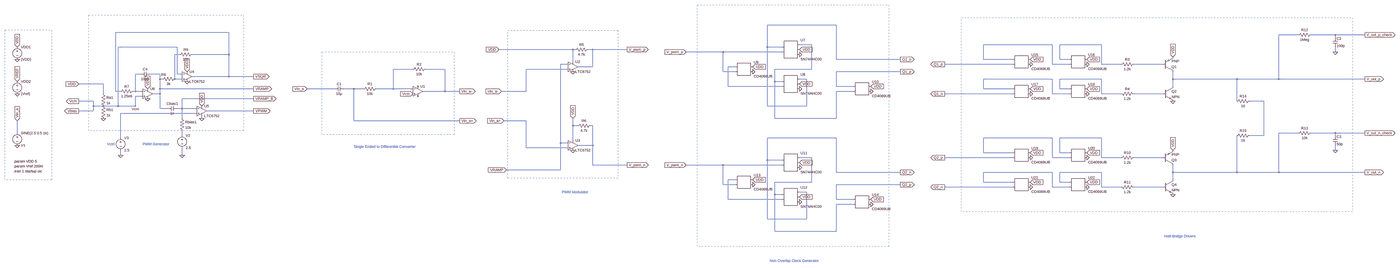
[diagram p0: schematic Ex 5.asc, whole sheet]
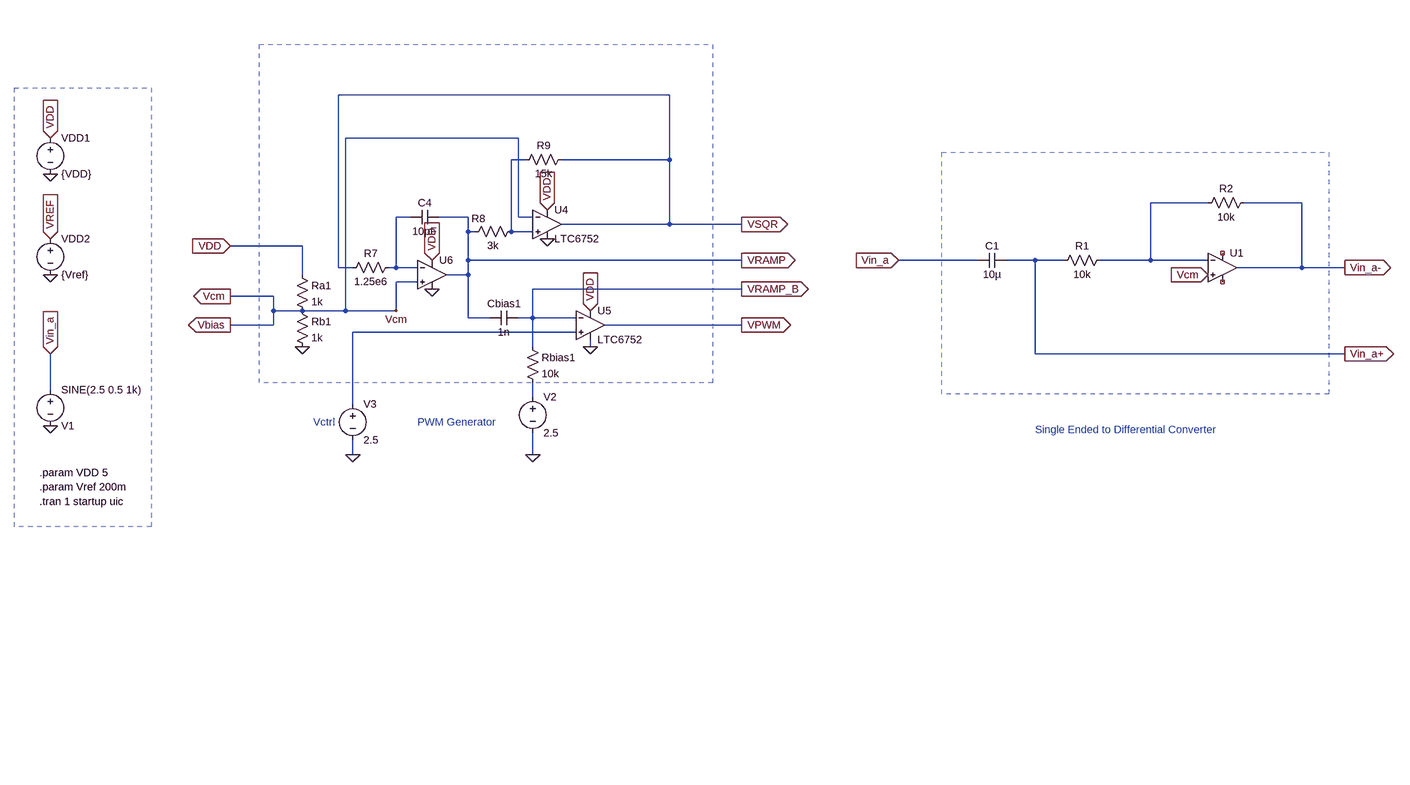
[diagram p1: schematic Ex 5.asc, part, row 1 of 1, column 1 of 3]
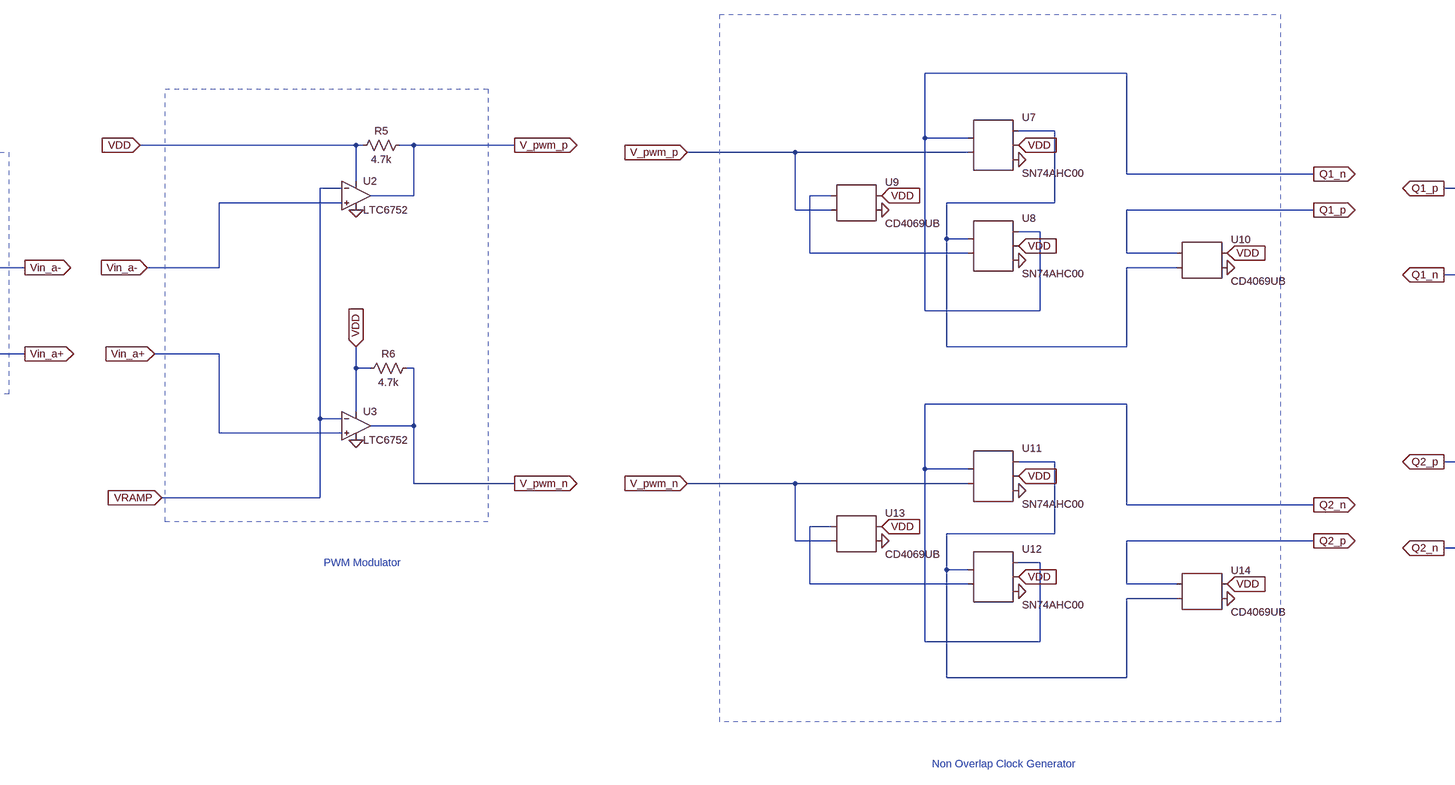
[diagram p2: schematic Ex 5.asc, part, row 1 of 1, column 2 of 3]
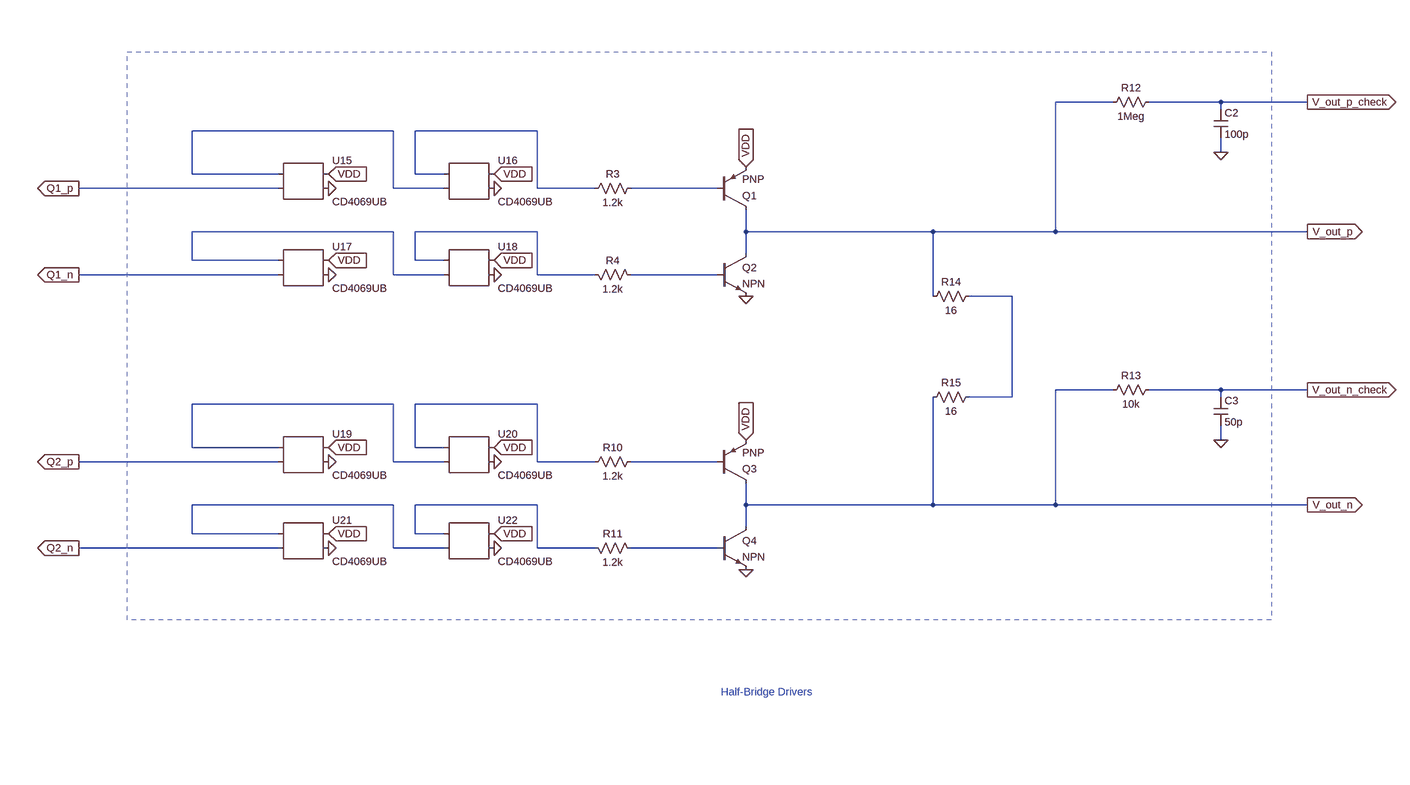
[diagram p3: schematic Ex 5.asc, part, row 1 of 1, column 3 of 3]
Ex 5.asc, the LTspice schematic file:
Version 4
SHEET 1 6252 1008
WIRE 2416 -544 1968 -544
WIRE -1536 -496 -2272 -496
WIRE 5584 -480 5456 -480
WIRE 5824 -480 5664 -480
WIRE 6016 -480 5824 -480
WIRE 5824 -464 5824 -480
WIRE 2256 -416 2176 -416
WIRE 3984 -416 3536 -416
WIRE 4304 -416 4032 -416
WIRE -1872 -400 -2256 -400
WIRE 1968 -400 1968 -544
WIRE 2064 -400 1968 -400
WIRE 704 -384 224 -384
WIRE 720 -384 704 -384
WIRE 832 -384 800 -384
WIRE 1056 -384 832 -384
WIRE 1680 -368 1440 -368
WIRE 2064 -368 1680 -368
WIRE 5824 -368 5824 -400
WIRE -1856 -352 -1888 -352
WIRE -1536 -352 -1536 -496
WIRE -1536 -352 -1776 -352
WIRE 2416 -320 2416 -544
WIRE 2832 -320 2416 -320
WIRE 3536 -320 3536 -416
WIRE 3728 -320 3536 -320
WIRE 4032 -320 4032 -416
WIRE 4096 -320 4032 -320
WIRE 704 -304 704 -384
WIRE 672 -288 624 -288
WIRE 3728 -288 3280 -288
WIRE 3984 -288 3984 -416
WIRE 4096 -288 3984 -288
WIRE 4304 -288 4304 -416
WIRE 4432 -288 4304 -288
WIRE 4704 -288 4512 -288
WIRE 832 -272 832 -384
WIRE 832 -272 736 -272
WIRE 1760 -272 1712 -272
WIRE -336 -256 -464 -256
WIRE -128 -256 -256 -256
WIRE 672 -256 400 -256
WIRE 2256 -256 2256 -416
WIRE 2256 -256 2016 -256
WIRE 1680 -240 1680 -368
WIRE 1760 -240 1680 -240
WIRE 2832 -240 2416 -240
WIRE -2112 -224 -2144 -224
WIRE -1984 -224 -2048 -224
WIRE -1872 -224 -1872 -400
WIRE -1840 -224 -1872 -224
WIRE -1536 -208 -1536 -352
WIRE -1536 -208 -1776 -208
WIRE -1376 -208 -1536 -208
WIRE -1984 -192 -1984 -224
WIRE -1968 -192 -1984 -192
WIRE -1888 -192 -1888 -352
WIRE -1840 -192 -1888 -192
WIRE 2224 -192 2176 -192
WIRE 3984 -192 3536 -192
WIRE 4304 -192 4032 -192
WIRE 4768 -192 4768 -240
WIRE 5184 -192 4768 -192
WIRE 5456 -192 5456 -480
WIRE 5456 -192 5184 -192
WIRE 6016 -192 5456 -192
WIRE 2016 -176 2016 -256
WIRE 2064 -176 2016 -176
WIRE -2352 -160 -2512 -160
WIRE 1712 -144 1712 -272
WIRE 2064 -144 1712 -144
WIRE 2416 -144 2416 -240
WIRE 2528 -144 2416 -144
WIRE 4768 -144 4768 -192
WIRE -1984 -128 -1984 -192
WIRE -1376 -128 -1984 -128
WIRE -848 -128 -1024 -128
WIRE -720 -128 -784 -128
WIRE -656 -128 -720 -128
WIRE -464 -128 -464 -256
WIRE -464 -128 -576 -128
WIRE -336 -128 -464 -128
WIRE 3536 -128 3536 -192
WIRE 3728 -128 3536 -128
WIRE 4032 -128 4032 -192
WIRE 4096 -128 4032 -128
WIRE -2272 -112 -2272 -496
WIRE -2240 -112 -2272 -112
WIRE -2144 -112 -2144 -224
WIRE -2144 -112 -2160 -112
WIRE -2096 -112 -2144 -112
WIRE -128 -112 -128 -256
WIRE -128 -112 -272 -112
WIRE -32 -112 -128 -112
WIRE 400 -112 400 -256
WIRE 400 -112 240 -112
WIRE 2528 -112 2416 -112
WIRE -2352 -96 -2352 -160
WIRE -1984 -96 -1984 -128
WIRE -1984 -96 -2032 -96
WIRE 3728 -96 3280 -96
WIRE 3984 -96 3984 -192
WIRE 4096 -96 3984 -96
WIRE 4304 -96 4304 -192
WIRE 4432 -96 4304 -96
WIRE 4704 -96 4512 -96
WIRE -2096 -80 -2144 -80
WIRE -1376 -64 -1840 -64
WIRE -2416 -48 -2512 -48
WIRE 5184 -48 5184 -192
WIRE 5360 -48 5264 -48
WIRE -2416 -16 -2416 -48
WIRE -2352 -16 -2416 -16
WIRE -2256 -16 -2256 -400
WIRE -2256 -16 -2352 -16
WIRE -2144 -16 -2144 -80
WIRE -2144 -16 -2256 -16
WIRE 1968 -16 1968 -400
WIRE 2224 -16 2224 -192
WIRE 2224 -16 1968 -16
WIRE -1984 0 -1984 -96
WIRE -1936 0 -1984 0
WIRE -1840 0 -1840 -64
WIRE -1840 0 -1872 0
WIRE -1744 0 -1840 0
WIRE -2416 16 -2416 -16
WIRE -2416 16 -2512 16
WIRE -1376 16 -1680 16
WIRE -1744 32 -2240 32
WIRE -1840 64 -1840 0
WIRE -1712 64 -1712 48
WIRE 2016 64 2016 -176
WIRE 2416 64 2416 -112
WIRE 2416 64 2016 64
WIRE -720 80 -720 -128
WIRE -32 80 -720 80
WIRE 400 80 256 80
WIRE 704 112 704 64
WIRE 736 112 704 112
WIRE 832 112 816 112
WIRE -2912 160 -2912 80
WIRE 5584 160 5456 160
WIRE 5824 160 5664 160
WIRE 6016 160 5824 160
WIRE -1840 176 -1840 144
WIRE 5360 176 5360 -48
WIRE 5360 176 5264 176
WIRE 5824 176 5824 160
WIRE -2240 192 -2240 32
WIRE 2416 192 1968 192
WIRE 3984 192 3536 192
WIRE 4304 192 4032 192
WIRE 704 208 704 112
WIRE 624 224 624 -288
WIRE 672 224 624 224
WIRE 832 240 832 112
WIRE 832 240 736 240
WIRE 400 256 400 80
WIRE 672 256 400 256
WIRE 5824 272 5824 240
WIRE 3536 288 3536 192
WIRE 3728 288 3536 288
WIRE 4032 288 4032 192
WIRE 4096 288 4032 288
WIRE -2240 304 -2240 272
WIRE -1840 304 -1840 256
WIRE 2256 320 2176 320
WIRE 3728 320 3280 320
WIRE 3984 320 3984 192
WIRE 4096 320 3984 320
WIRE 4304 320 4304 192
WIRE 4432 320 4304 320
WIRE 4704 320 4512 320
WIRE 1968 336 1968 192
WIRE 2064 336 1968 336
WIRE 832 368 832 240
WIRE 1056 368 832 368
WIRE 1680 368 1440 368
WIRE 2064 368 1680 368
WIRE 624 400 624 224
WIRE 624 400 272 400
WIRE 2416 416 2416 192
WIRE 2832 416 2416 416
WIRE 3984 416 3536 416
WIRE 4304 416 4032 416
WIRE 4768 416 4768 368
WIRE 5184 416 5184 176
WIRE 5184 416 4768 416
WIRE 5456 416 5456 160
WIRE 5456 416 5184 416
WIRE 6016 416 5456 416
WIRE 1760 464 1712 464
WIRE 4768 464 4768 416
WIRE 2256 480 2256 320
WIRE 2256 480 2016 480
WIRE 3536 480 3536 416
WIRE 3728 480 3536 480
WIRE 4032 480 4032 416
WIRE 4096 480 4032 480
WIRE 1680 496 1680 368
WIRE 1760 496 1680 496
WIRE 2832 496 2416 496
WIRE 3728 512 3280 512
WIRE 3984 512 3984 416
WIRE 4096 512 3984 512
WIRE 4304 512 4304 416
WIRE 4432 512 4304 512
WIRE 4704 512 4512 512
WIRE 2224 544 2176 544
WIRE 2016 560 2016 480
WIRE 2064 560 2016 560
WIRE 1712 592 1712 464
WIRE 2064 592 1712 592
WIRE 2416 592 2416 496
WIRE 2528 592 2416 592
WIRE 2528 624 2416 624
WIRE 1968 720 1968 336
WIRE 2224 720 2224 544
WIRE 2224 720 1968 720
WIRE 2016 800 2016 560
WIRE 2416 800 2416 624
WIRE 2416 800 2016 800
FLAG -1024 -128 Vin_a
IOPIN -1024 -128 In
FLAG -32 -112 Vin_a-
IOPIN -32 -112 Out
FLAG -32 80 Vin_a+
IOPIN -32 80 Out
FLAG 272 400 VRAMP
IOPIN 272 400 In
FLAG 240 -112 Vin_a-
IOPIN 240 -112 In
FLAG 256 80 Vin_a+
IOPIN 256 80 In
FLAG 1056 -384 V_pwm_p
IOPIN 1056 -384 Out
FLAG 1056 368 V_pwm_n
IOPIN 1056 368 Out
FLAG 224 -384 VDD
IOPIN 224 -384 In
FLAG 704 64 VDD
IOPIN 704 64 In
FLAG 704 -240 0
FLAG 704 272 0
FLAG -2912 240 0
FLAG -2912 80 Vin_a
IOPIN -2912 80 In
FLAG -336 -96 Vcm
IOPIN -336 -96 In
FLAG -2352 64 0
FLAG -1808 -176 0
FLAG -2064 -64 0
FLAG -1712 64 0
FLAG -2144 -16 Vcm
FLAG -1376 -208 VSQR
IOPIN -1376 -208 Out
FLAG -1376 -128 VRAMP
IOPIN -1376 -128 Out
FLAG -2064 -128 VDD
IOPIN -2064 -128 In
FLAG -1808 -240 VDD
IOPIN -1808 -240 In
FLAG -1712 -16 VDD
IOPIN -1712 -16 In
FLAG -1376 16 VPWM
IOPIN -1376 16 Out
FLAG -1376 -64 VRAMP_B
IOPIN -1376 -64 Out
FLAG -2512 -160 VDD
IOPIN -2512 -160 In
FLAG -2912 -320 0
FLAG -2912 -400 VDD
IOPIN -2912 -400 In
FLAG -2912 -96 0
FLAG -2912 -176 VREF
IOPIN -2912 -176 In
FLAG -1840 304 0
FLAG -2240 304 0
FLAG -2512 -48 Vcm
IOPIN -2512 -48 Out
FLAG -2512 16 Vbias
IOPIN -2512 16 Out
FLAG 2176 -384 VDD
IOPIN 2176 -384 In
FLAG 2176 -160 VDD
IOPIN 2176 -160 In
FLAG 2176 -352 0
FLAG 2176 -128 0
FLAG 1440 -368 V_pwm_p
IOPIN 1440 -368 In
FLAG 2832 -320 Q1_n
IOPIN 2832 -320 Out
FLAG 2832 -240 Q1_p
IOPIN 2832 -240 Out
FLAG 2640 -144 VDD
IOPIN 2640 -144 In
FLAG 2640 -112 0
FLAG 2176 352 VDD
IOPIN 2176 352 In
FLAG 2176 576 VDD
IOPIN 2176 576 In
FLAG 2176 384 0
FLAG 2176 608 0
FLAG 1440 368 V_pwm_n
IOPIN 1440 368 In
FLAG 2832 416 Q2_n
IOPIN 2832 416 Out
FLAG 2832 496 Q2_p
IOPIN 2832 496 Out
FLAG 2640 592 VDD
IOPIN 2640 592 In
FLAG 2640 624 0
FLAG 1872 -272 VDD
IOPIN 1872 -272 In
FLAG 1872 464 VDD
IOPIN 1872 464 In
FLAG 1872 -240 0
FLAG 1872 496 0
FLAG 3840 -320 VDD
IOPIN 3840 -320 In
FLAG 3840 -128 VDD
IOPIN 3840 -128 In
FLAG 4208 -320 VDD
IOPIN 4208 -320 In
FLAG 4208 -128 VDD
IOPIN 4208 -128 In
FLAG 3840 -288 0
FLAG 3840 -96 0
FLAG 4208 -288 0
FLAG 4208 -96 0
FLAG 4768 -336 VDD
IOPIN 4768 -336 In
FLAG 4768 -48 0
FLAG 3280 -288 Q1_p
IOPIN 3280 -288 Out
FLAG 3280 -96 Q1_n
IOPIN 3280 -96 Out
FLAG 6016 -192 V_out_p
IOPIN 6016 -192 Out
FLAG 3840 288 VDD
IOPIN 3840 288 In
FLAG 3840 480 VDD
IOPIN 3840 480 In
FLAG 4208 288 VDD
IOPIN 4208 288 In
FLAG 4208 480 VDD
IOPIN 4208 480 In
FLAG 3840 320 0
FLAG 3840 512 0
FLAG 4208 320 0
FLAG 4208 512 0
FLAG 4768 272 VDD
IOPIN 4768 272 In
FLAG 4768 560 0
FLAG 3280 320 Q2_p
IOPIN 3280 320 Out
FLAG 3280 512 Q2_n
IOPIN 3280 512 Out
FLAG 6016 416 V_out_n
IOPIN 6016 416 Out
FLAG 5824 -368 0
FLAG 6016 -480 V_out_p_check
IOPIN 6016 -480 Out
FLAG 5824 272 0
FLAG 6016 160 V_out_n_check
IOPIN 6016 160 Out
SYMBOL cap -784 -144 R90
WINDOW 0 0 32 VBottom 2
WINDOW 3 32 32 VTop 2
SYMATTR InstName C1
SYMATTR Value 10µ
SYMBOL res -560 -144 R90
WINDOW 0 0 56 VBottom 2
WINDOW 3 32 56 VTop 2
SYMATTR InstName R1
SYMATTR Value 10k
SYMBOL res -240 -272 R90
WINDOW 0 0 56 VBottom 2
WINDOW 3 32 56 VTop 2
SYMATTR InstName R2
SYMATTR Value 10k
SYMBOL OpAmps\\UniversalOpAmp -304 -112 R0
SYMATTR InstName U1
SYMBOL Comparators\\LTC6752 704 -336 R0
SYMATTR InstName U2
SYMBOL Comparators\\LTC6752 704 176 R0
SYMATTR InstName U3
SYMBOL res 816 -400 R90
WINDOW 0 0 56 VBottom 2
WINDOW 3 32 56 VTop 2
SYMATTR InstName R5
SYMATTR Value 4.7k
SYMBOL res 832 96 R90
WINDOW 0 0 56 VBottom 2
WINDOW 3 32 56 VTop 2
SYMATTR InstName R6
SYMATTR Value 4.7k
SYMBOL voltage -2912 144 R0
WINDOW 0 24 96 Left 2
WINDOW 3 24 16 Left 2
WINDOW 123 0 0 Left 0
WINDOW 39 0 0 Left 0
SYMATTR InstName V1
SYMATTR Value SINE(2.5 0.5 1k)
SYMBOL res -2368 -112 R0
SYMATTR InstName Ra1
SYMATTR Value 1k
SYMBOL res -2368 -32 R0
SYMATTR InstName Rb1
SYMATTR Value 1k
SYMBOL res -2144 -128 R90
WINDOW 0 0 56 VBottom 2
WINDOW 3 32 56 VTop 2
SYMATTR InstName R7
SYMATTR Value 1.25e6
SYMBOL cap -2048 -240 R90
WINDOW 0 0 32 VBottom 2
WINDOW 3 32 32 VTop 2
SYMATTR InstName C4
SYMATTR Value 10pF
SYMBOL res -1872 -208 R90
WINDOW 0 3 89 VBottom 2
WINDOW 3 32 56 VTop 2
SYMATTR InstName R8
SYMATTR Value 3k
SYMBOL res -1760 -368 R90
WINDOW 0 0 56 VBottom 2
WINDOW 3 32 56 VTop 2
SYMATTR InstName R9
SYMATTR Value 15k
SYMBOL cap -1872 -16 R90
WINDOW 0 0 32 VBottom 2
WINDOW 3 32 32 VTop 2
SYMATTR InstName Cbias1
SYMATTR Value 1n
SYMBOL res -1856 48 R0
SYMATTR InstName Rbias1
SYMATTR Value 10k
SYMBOL voltage -1840 160 R0
WINDOW 123 0 0 Left 0
WINDOW 39 0 0 Left 0
SYMATTR InstName V2
SYMATTR Value 2.5
SYMBOL Comparators\\LTC6752 -1808 -272 R0
SYMATTR InstName U4
SYMBOL Comparators\\LTC6752 -1712 -48 R0
SYMATTR InstName U5
SYMBOL OpAmps\\UniversalOpamp2 -2064 -96 R0
SYMATTR InstName U6
SYMBOL voltage -2912 -416 R0
WINDOW 123 0 0 Left 0
WINDOW 39 0 0 Left 0
SYMATTR InstName VDD1
SYMATTR Value {VDD}
SYMBOL voltage -2912 -192 R0
WINDOW 123 0 0 Left 0
WINDOW 39 0 0 Left 0
SYMATTR InstName VDD2
SYMATTR Value {Vref}
SYMBOL voltage -2240 176 R0
WINDOW 123 0 0 Left 0
WINDOW 39 0 0 Left 0
SYMATTR InstName V3
SYMATTR Value 2.5
SYMBOL AutoGenerated\\SN74AHC00 2112 -384 R0
SYMATTR InstName U7
SYMBOL AutoGenerated\\SN74AHC00 2112 -160 R0
SYMATTR InstName U8
SYMBOL AutoGenerated\\CD4069UB 1808 -256 R0
SYMATTR InstName U9
SYMBOL AutoGenerated\\CD4069UB 2576 -128 R0
SYMATTR InstName U10
SYMBOL AutoGenerated\\SN74AHC00 2112 352 R0
SYMATTR InstName U11
SYMBOL AutoGenerated\\SN74AHC00 2112 576 R0
SYMATTR InstName U12
SYMBOL AutoGenerated\\CD4069UB 1808 480 R0
SYMATTR InstName U13
SYMBOL AutoGenerated\\CD4069UB 2576 608 R0
SYMATTR InstName U14
SYMBOL AutoGenerated\\CD4069UB 3776 -304 R0
SYMATTR InstName U15
SYMBOL AutoGenerated\\CD4069UB 4144 -304 R0
SYMATTR InstName U16
SYMBOL AutoGenerated\\CD4069UB 3776 -112 R0
SYMATTR InstName U17
SYMBOL AutoGenerated\\CD4069UB 4144 -112 R0
SYMATTR InstName U18
SYMBOL res 4528 -304 R90
WINDOW 0 0 56 VBottom 2
WINDOW 3 32 56 VTop 2
SYMATTR InstName R3
SYMATTR Value 1.2k
SYMBOL pnp 4704 -240 M180
SYMATTR InstName Q1
SYMBOL res 4416 -112 M90
WINDOW 0 0 56 VBottom 2
WINDOW 3 32 56 VTop 2
SYMATTR InstName R4
SYMATTR Value 1.2k
SYMBOL npn 4704 -144 R0
SYMATTR InstName Q2
SYMBOL AutoGenerated\\CD4069UB 3776 304 R0
SYMATTR InstName U19
SYMBOL AutoGenerated\\CD4069UB 4144 304 R0
SYMATTR InstName U20
SYMBOL AutoGenerated\\CD4069UB 3776 496 R0
SYMATTR InstName U21
SYMBOL AutoGenerated\\CD4069UB 4144 496 R0
SYMATTR InstName U22
SYMBOL res 4528 304 R90
WINDOW 0 0 56 VBottom 2
WINDOW 3 32 56 VTop 2
SYMATTR InstName R10
SYMATTR Value 1.2k
SYMBOL pnp 4704 368 M180
SYMATTR InstName Q3
SYMBOL res 4416 496 M90
WINDOW 0 0 56 VBottom 2
WINDOW 3 32 56 VTop 2
SYMATTR InstName R11
SYMATTR Value 1.2k
SYMBOL npn 4704 464 R0
SYMATTR InstName Q4
SYMBOL res 5680 -496 R90
WINDOW 0 0 56 VBottom 2
WINDOW 3 32 56 VTop 2
SYMATTR InstName R12
SYMATTR Value 1Meg
SYMBOL cap 5808 -464 R0
SYMATTR InstName C2
SYMATTR Value 100p
SYMBOL res 5680 144 R90
WINDOW 0 0 56 VBottom 2
WINDOW 3 32 56 VTop 2
SYMATTR InstName R13
SYMATTR Value 10k
SYMBOL cap 5808 176 R0
SYMATTR InstName C3
SYMATTR Value 50p
SYMBOL res 5280 -64 R90
WINDOW 0 0 56 VBottom 2
WINDOW 3 32 56 VTop 2
SYMATTR InstName R14
SYMATTR Value 16
SYMBOL res 5280 160 R90
WINDOW 0 0 56 VBottom 2
WINDOW 3 32 56 VTop 2
SYMATTR InstName R15
SYMATTR Value 16
TEXT -2936 408 Left 2 !.tran 1 startup uic
TEXT -720 248 Left 2 ;Single Ended to Differential Converter
TEXT 632 544 Left 2 ;PWM Modulator
TEXT -2936 344 Left 2 !.param VDD 5
TEXT -2936 376 Left 2 !.param Vref 200m
TEXT -2328 232 Left 2 ;Vctrl
TEXT -2096 232 Left 2 ;PWM Generator
TEXT 1984 992 Left 2 ;Non Overlap Clock Generator
TEXT 4712 832 Left 2 ;Half-Bridge Drivers
RECTANGLE Normal -2688 464 -2992 -512 2
RECTANGLE Normal -1440 144 -2448 -608 1
RECTANGLE Normal -68 169 -928 -368 1
RECTANGLE Normal 997 453 280 -509 1
RECTANGLE Normal 2758 898 1512 -675 1
RECTANGLE Normal 5936 672 3392 -592 1

The netlist it stands for:
* Ex 5.asc
C1 Vin_a+ Vin_a 10µ
R1 N007 Vin_a+ 10k
R2 Vin_a- N007 10k
XU1 Vbias N007 NC_01 NC_02 Vin_a- level1 Avol=1Meg GBW=10Meg Vos=0 En=0 Enk=0 In=0 Ink=0 Rin=500Meg  ; pins In+ In- V+ V- OUT
XU2 Vin_a- VRAMP VDD 0 V_pwm_p LTC6752  ; pins In+ In- V+ V- OUT
XU3 Vin_a+ VRAMP VDD 0 V_pwm_n LTC6752  ; pins In+ In- V+ V- OUT
R5 V_pwm_p VDD 4.7k
R6 V_pwm_n VDD 4.7k
V1 Vin_a 0 SINE(2.5 0.5 1k)
Ra1 VDD Vbias 1k
Rb1 Vbias 0 1k
R7 N008 VSQR 1.25e6
C4 VRAMP N008 10pF
R8 N004 VRAMP 3k
R9 VSQR N004 15k
Cbias1 VRAMP_B VRAMP 1n
Rbias1 VRAMP_B N014 10k
V2 N014 0 2.5
XU4 N004 Vbias VDD 0 VSQR LTC6752  ; pins In+ In- V+ V- OUT
XU5 N013 VRAMP_B VDD 0 VPWM LTC6752  ; pins In+ In- V+ V- OUT
XU6 Vbias N008 VDD 0 VRAMP level.2 Avol=1Meg GBW=10Meg Slew=10Meg ilimit=25m rail=0 Vos=0 phimargin=45 en=0 enk=0 in=0 ink=0 Rin=500Meg  ; pins IN+ IN- V+ V- OUT
VDD1 VDD 0 {VDD}
VDD2 VREF 0 {Vref}
V3 N013 0 2.5
* U7: SN74AHC00 (symbol AutoGenerated\SN74AHC00 not available, pins judged from their places): pin1=Q1_n pin2=V_pwm_p pin3=N001 pin4=VDD pin5=0
* U8: SN74AHC00 (symbol AutoGenerated\SN74AHC00 not available, pins judged from their places): pin1=N001 pin2=N006 pin3=Q1_n pin4=VDD pin5=0
* U9: CD4069UB (symbol AutoGenerated\CD4069UB not available, pins judged from their places): pin1=N006 pin2=V_pwm_p pin3=VDD pin4=0
* U10: CD4069UB (symbol AutoGenerated\CD4069UB not available, pins judged from their places): pin1=Q1_p pin2=N001 pin3=VDD pin4=0
* U11: SN74AHC00 (symbol AutoGenerated\SN74AHC00 not available, pins judged from their places): pin1=Q2_n pin2=V_pwm_n pin3=N017 pin4=VDD pin5=0
* U12: SN74AHC00 (symbol AutoGenerated\SN74AHC00 not available, pins judged from their places): pin1=N017 pin2=N021 pin3=Q2_n pin4=VDD pin5=0
* U13: CD4069UB (symbol AutoGenerated\CD4069UB not available, pins judged from their places): pin1=N021 pin2=V_pwm_n pin3=VDD pin4=0
* U14: CD4069UB (symbol AutoGenerated\CD4069UB not available, pins judged from their places): pin1=Q2_p pin2=N017 pin3=VDD pin4=0
* U15: CD4069UB (symbol AutoGenerated\CD4069UB not available, pins judged from their places): pin1=N002 pin2=Q1_p pin3=VDD pin4=0
* U16: CD4069UB (symbol AutoGenerated\CD4069UB not available, pins judged from their places): pin1=N003 pin2=N002 pin3=VDD pin4=0
* U17: CD4069UB (symbol AutoGenerated\CD4069UB not available, pins judged from their places): pin1=N009 pin2=Q1_n pin3=VDD pin4=0
* U18: CD4069UB (symbol AutoGenerated\CD4069UB not available, pins judged from their places): pin1=N010 pin2=N009 pin3=VDD pin4=0
R3 N005 N003 1.2k
Q1 V_out_p N005 VDD 0 PNP
R4 N010 N011 1.2k
Q2 V_out_p N011 0 0 NPN
* U19: CD4069UB (symbol AutoGenerated\CD4069UB not available, pins judged from their places): pin1=N015 pin2=Q2_p pin3=VDD pin4=0
* U20: CD4069UB (symbol AutoGenerated\CD4069UB not available, pins judged from their places): pin1=N016 pin2=N015 pin3=VDD pin4=0
* U21: CD4069UB (symbol AutoGenerated\CD4069UB not available, pins judged from their places): pin1=N019 pin2=Q2_n pin3=VDD pin4=0
* U22: CD4069UB (symbol AutoGenerated\CD4069UB not available, pins judged from their places): pin1=N020 pin2=N019 pin3=VDD pin4=0
R10 N018 N016 1.2k
Q3 V_out_n N018 VDD 0 PNP
R11 N020 N022 1.2k
Q4 V_out_n N022 0 0 NPN
R12 V_out_p_check V_out_p 1Meg
C2 V_out_p_check 0 100p
R13 V_out_n_check V_out_n 10k
C3 V_out_n_check 0 50p
R14 N012 V_out_p 16
R15 N012 V_out_n 16
.model NPN NPN
.model PNP PNP
.lib standard.bjt
.tran 1 startup uic
* Single Ended to Differential Converter
* PWM Modulator
.param VDD 5
.param Vref 200m
* Vctrl
* PWM Generator
* Non Overlap Clock Generator
* Half-Bridge Drivers
.lib UniversalOpAmp1.lib
.lib LTC7.lib
.lib UniversalOpamps2.sub
.backanno
.end